# EasyEDA Pro project Portas Logicas.eprj

# Schematic Schematic1
Board Name: Board1; Create Date: 2025-02-13; Page Name: P1; Project Name: Portas Logicas; Schematic Name: Schematic1; Update Date: 2025-02-13; Company: EasyEDA.com; Page Size: A4; Version: V1.0
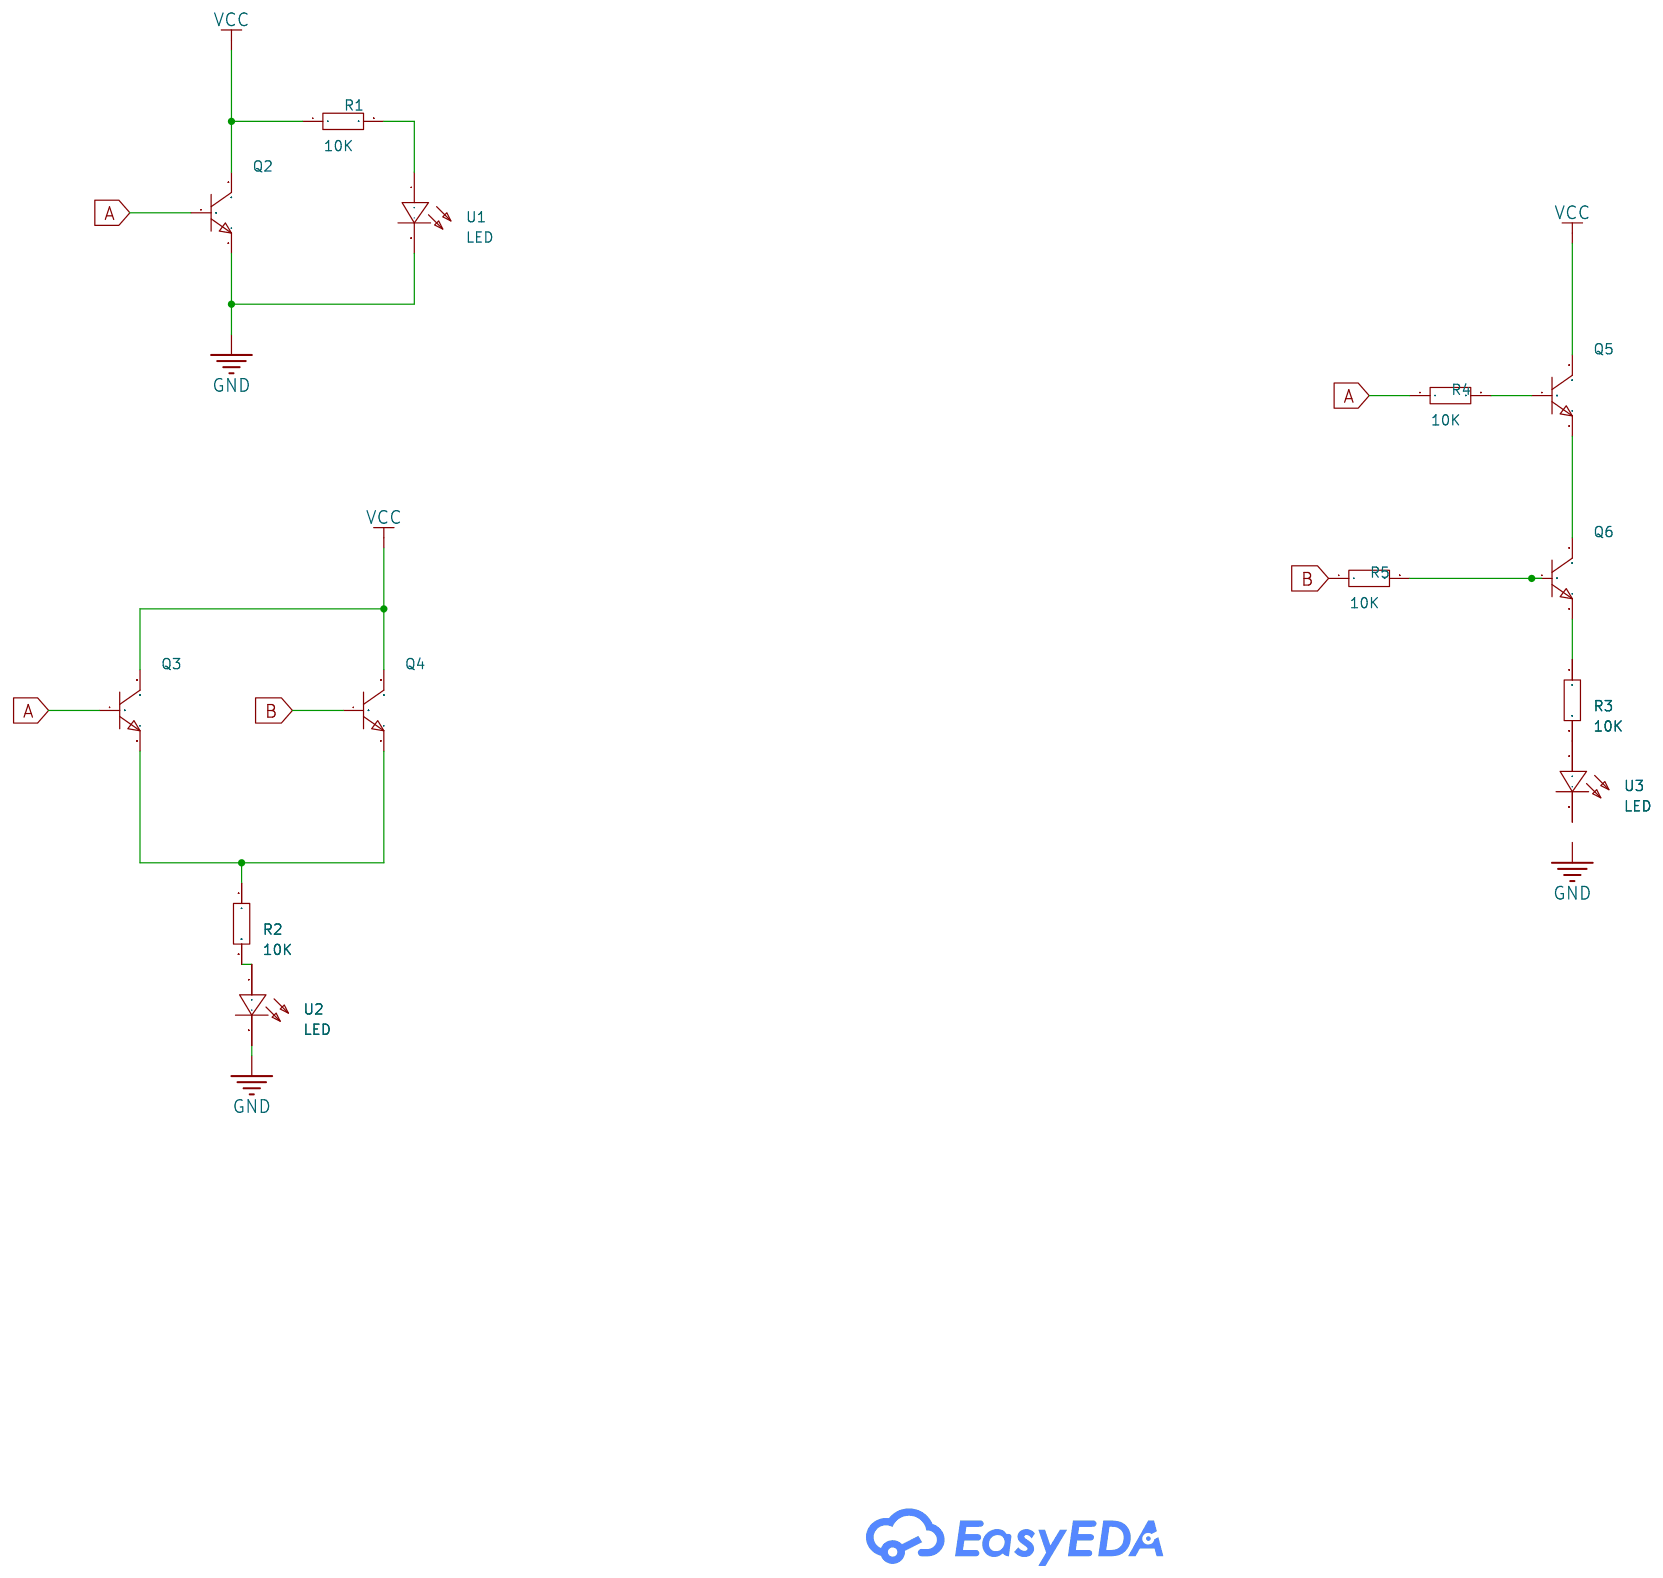
[diagram p0: schematic sheet]

## Parts
Q2  -  [SOT-23_L2.9-W1.3-P1.90-LS2.4-BR]
Q3  -  [SOT-23_L2.9-W1.3-P1.90-LS2.4-BR]
Q4  -  [SOT-23_L2.9-W1.3-P1.90-LS2.4-BR]
Q5  -  [SOT-23_L2.9-W1.3-P1.90-LS2.4-BR]
Q6  -  [SOT-23_L2.9-W1.3-P1.90-LS2.4-BR]
R1  10K  [R0603]
R2  10K  [R0603]
R3  10K  [R0603]
R4  10K  [R0603]
R5  10K  [R0603]
U1  LED  [LED-TH_BD4.0-P2.54-FD_RED]
U2  LED  [LED-TH_BD4.0-P2.54-FD_RED]
U3  LED  [LED-TH_BD4.0-P2.54-FD_RED]

## Library data of the parts
Q2-Q6 = S8050_NPN: Supplier Footprint: SOT-23
R1-R5 = Res_0603: Supplier Footprint: 0603
U1-U3 = LED: Supplier Part: C9900015665; Supplier Footprint: SIP-2P; JLCPCB Part Class: Extended Part; Supplier: LCSC

## Nets
GND: Q2.2(E) U1.2(-) U2.2(-)
VCC: Q2.3(C) Q3.3(C) Q4.3(C) Q5.3(C) R1.1
A: Q2.1(B) Q3.1(B) R4.1
B: Q4.1(B) R5.1
Net-(Q3-2): Q3.2(E) Q4.2(E) R2.1
Net-(Q5-1): Q5.1(B) R4.2
Net-(Q5-2): Q5.2(E) Q6.3(C)
Net-(Q6-1): Q6.1(B) R5.2
Net-(Q6-2): Q6.2(E) R3.1
Net-(R1-2): R1.2 U1.1(+)
Net-(R2-2): R2.2 U2.1(+)
Net-(R3-2): R3.2 U3.1(+)

Not connected (* = marked no-connect by the designer): U3 2(-)
